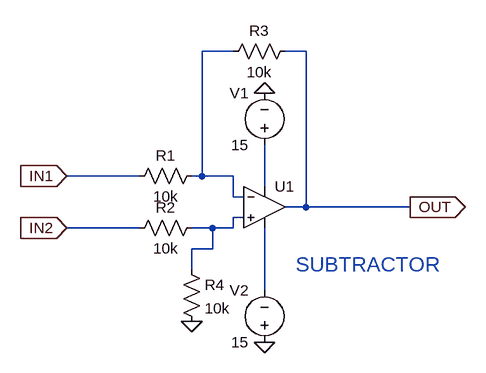
[diagram p0: schematic subtractorblock.asc]
subtractorblock.asc, the LTspice schematic file:
Version 4.1
SHEET 1 880 680
WIRE 128 -64 80 -64
WIRE 240 -64 208 -64
WIRE -16 128 -128 128
WIRE 80 128 80 -64
WIRE 80 128 64 128
WIRE 128 128 80 128
WIRE 176 144 176 80
WIRE 128 160 128 128
WIRE 144 160 128 160
WIRE 240 176 240 -64
WIRE 240 176 208 176
WIRE 400 176 240 176
WIRE 144 192 128 192
WIRE -16 208 -128 208
WIRE 96 208 64 208
WIRE 128 208 128 192
WIRE 128 208 96 208
WIRE 96 240 96 208
WIRE 96 240 64 240
WIRE 64 272 64 240
WIRE 176 304 176 208
FLAG 176 384 0
FLAG 176 0 0
FLAG 64 352 0
FLAG -128 128 IN1
IOPIN -128 128 In
FLAG -128 208 IN2
IOPIN -128 208 In
FLAG 400 176 OUT
IOPIN 400 176 Out
SYMBOL OpAmps\\UniversalOpAmp 176 176 R0
SYMATTR InstName U1
SYMBOL voltage 176 96 R180
WINDOW 0 24 96 Left 2
WINDOW 3 24 16 Left 2
WINDOW 123 0 0 Left 0
WINDOW 39 0 0 Left 0
SYMATTR InstName V1
SYMATTR Value 15
SYMBOL voltage 176 400 R180
WINDOW 0 24 96 Left 2
WINDOW 3 24 16 Left 2
WINDOW 123 0 0 Left 0
WINDOW 39 0 0 Left 0
SYMATTR InstName V2
SYMATTR Value 15
SYMBOL res 80 112 R90
WINDOW 0 0 56 VBottom 2
WINDOW 3 32 56 VTop 2
SYMATTR InstName R1
SYMATTR Value 10k
SYMBOL res 80 192 R90
WINDOW 0 0 56 VBottom 2
WINDOW 3 32 56 VTop 2
SYMATTR InstName R2
SYMATTR Value 10k
SYMBOL res 224 -80 R90
WINDOW 0 0 56 VBottom 2
WINDOW 3 32 56 VTop 2
SYMATTR InstName R3
SYMATTR Value 10k
SYMBOL res 48 256 R0
SYMATTR InstName R4
SYMATTR Value 10k
TEXT 224 264 Left 3 ;SUBTRACTOR

The netlist it stands for:
* subtractorblock.asc
X§U1 N003 N001 N002 N004 OUT level1 Avol=1Meg GBW=10Meg Vos=0 En=0 Enk=0 In=0 Ink=0 Rin=500Meg  ; pins In+ In- V+ V- OUT
V1 N002 0 15
V2 0 N004 15
R1 N001 IN1 10k
R2 N003 IN2 10k
R3 OUT N001 10k
R4 N003 0 10k
* SUBTRACTOR
.lib UniversalOpAmp1.lib
.backanno
.end